# EAGLE schematic TPT02rrrrrrr (EAGLE 7.7.0)
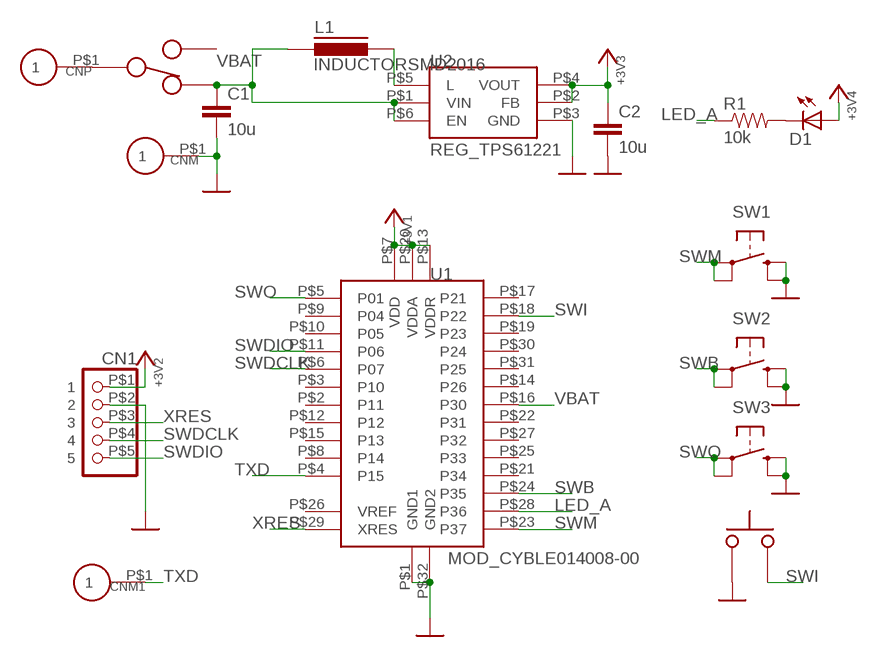
[diagram p0: schematic, sheet 1]

## Parts
C1  10u  CAP0603  [0603]
C2  10u  CAP0603  [0603]
CN1  CON_PINHD-1X550MIL  [1X5_50MIL]
CNM  CON_P01SMD1MM  [PAD_SMD1MM]
CNM1  CON_P01SMD1MM  [PAD_SMD1MM]
CNP  CON_P01SMD1MM  [PAD_SMD1MM]
D1  LED0603  [SPARKFUN_LED-0603]
L1  INDUCTORSMD2016  [2016]
R1  10k  RES0603  [0603]
SW1  SW_TACTEVQP2  [SW_EVQP2]
SW2  SW_TACTEVQPLNA08NOGND  [SW_EVQPLBA08_NOGND]
SW3  SW_TACTEVQPLNA08NOGND  [SW_EVQPLBA08_NOGND]
SW4  SW_SLIDECUS12B  [SW_CUS-12B]
SW5  SW_TACT2PB3U3000  [SW_B3U-3000P]
U1  MOD_CYBLE014008-00  [MOD_CYBLE014008-00]
U2  REG_TPS61221  [SC70-6]

## Nets
+3V3: C2.1 CN1.P$1 D1.A U1.P$7(VDD) U1.P$13(VDDR) U1.P$20(VDDA) U2.P$2(FB) U2.P$4(VOUT) ; supply symbol labelled POW_+3V3
GND: C1.2 C2.2 CN1.P$2 CNM.P$1 SW1.PB1(S) SW1.PB2(S1) SW2.B1(S) SW2.B2(S1) SW3.B1(S) SW3.B2(S1) SW5.P$2 U1.P$1(GND1) U1.P$32(GND2) U2.P$3(GND) ; supply symbol labelled POW_GND
LED_A: R1.1 U1.P$28(P36)
N$2: L1.P$2 U2.P$5(L)
N$7: D1.C R1.2
N$8: CNP.P$1 SW4.P$2
SWB: SW2.A1(P) SW2.A2(P1) U1.P$24(P35)
SWDCLK: CN1.P$4 U1.P$6(P07)
SWDIO: CN1.P$5 U1.P$11(P06)
SWI: SW5.P$1 U1.P$18(P22)
SWM: SW1.PA1(P) SW1.PA2(P1) U1.P$23(P37)
SWO: SW3.A1(P) SW3.A2(P1) U1.P$5(P01)
TXD: CNM1.P$1 U1.P$4(P15)
VBAT: C1.1 L1.P$1 SW4.P$1 U1.P$16(P30) U2.P$1(VIN) U2.P$6(EN)
XRES: CN1.P$3 U1.P$29(XRES)
Unconnected: U1.P$2(P11) U1.P$3(P10) U1.P$8(P14) U1.P$9(P04) U1.P$10(P05) U1.P$12(P12) U1.P$14(P26) U1.P$15(P13) U1.P$17(P21) U1.P$19(P23) U1.P$21(P34) U1.P$22(P31) U1.P$25(P33) U1.P$26(VREF) U1.P$27(P32) U1.P$30(P24) U1.P$31(P25)

## Power pins joined to a net without a drawn wire
P$3: SW4.P$3

## Library data of the parts
C1 C2 = akita:CAP: Capacitor Standard 0603 ceramic capacitor, and 0.1" leaded capacitor.
CN1 = akita:CON_PINHD-1X5: PIN HEADER
CNM CNM1 CNP = akita:CON_P01
D1 = akita:LED: LEDs Standard schematic elements and footprints for 5mm, 3mm, 1206, and 0603 sized LEDs. 5mm - Spark Fun Electronics SKU : COM-00529 (and others)
L1 = akita:INDUCTOR: Inductor
R1 = akita:RES: Resistor Basic schematic elements and footprints for 0603, 1206, and PTH resistors.
SW1-SW3 = akita:SW_TACT: OMRON SWITCH
SW4 = akita:SW_SLIDE
SW5 = akita:SW_TACT2P: OMRON SWITCH
U1 = akita:MOD_CYBLE014008-00: Cypress CYBLE014008-000
U2 = akita:REG_TPS61221: TI's TPS61220/1/2, boost DC/DC